# Altium schematic sheet Sheet_manual.SchDoc
size A3
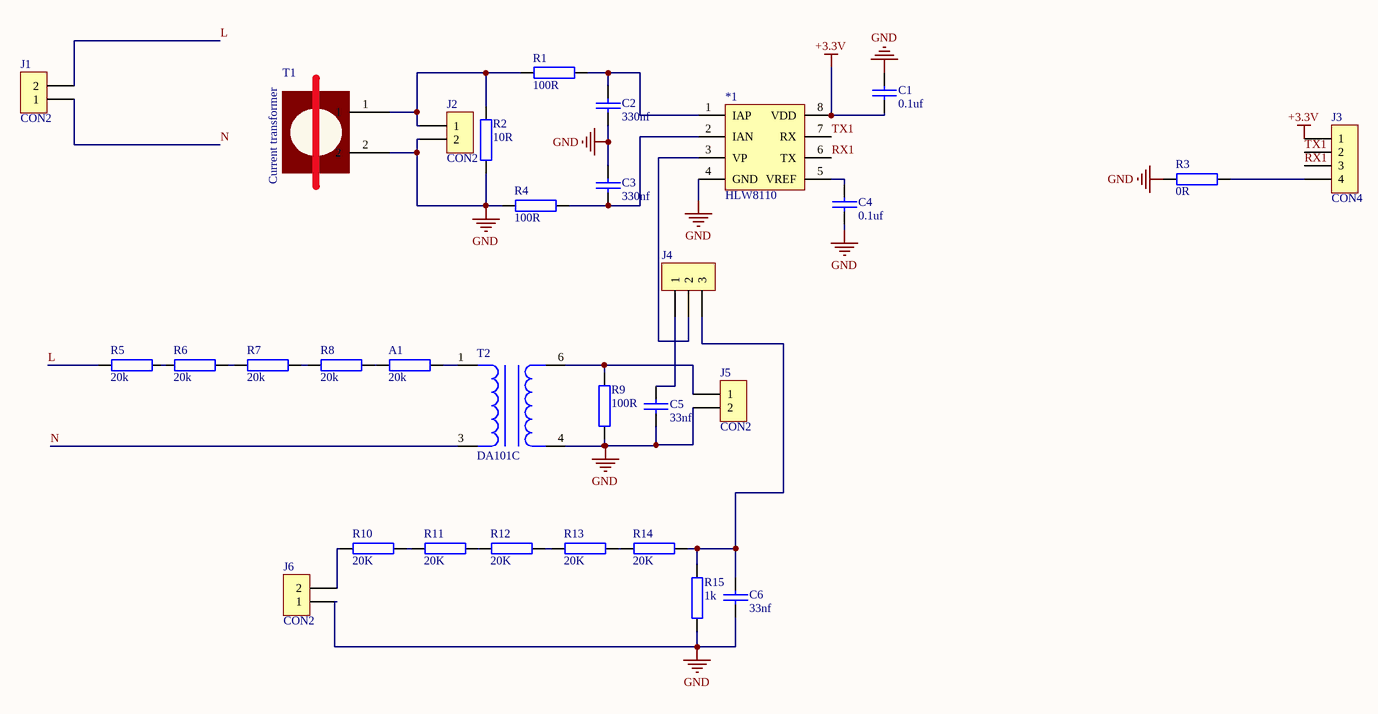
[diagram p0: Sheet_manual.SchDoc]

## Parts
*1  HLW8110  [SOP8W_M]
A1  20k  [AXIAL0.4]
C1  0.1uf  [CAP2]
C2  330nf  [CAP2]
C3  330nf  [CAP2]
C4  0.1uf  [CAP2]
C5  33nf  [CAP2]
C6  33nf  [CAP2]
J1  CON2  [KF128-3.81-2P]
J2  CON2  [sip-2]
J3  CON4  [sip-4]
J4  CON3  [sip-3]  (value not drawn)
J5  CON2  [sip-2]
J6  CON2  [sip-2]
R1  100R  [AXIAL0.4]
R2  10R  [AXIAL0.4]
R3  0R  [AXIAL0.4]
R4  100R  [AXIAL0.4]
R5  20k  [AXIAL0.4]
R6  20k  [AXIAL0.4]
R7  20k  [AXIAL0.4]
R8  20k  [AXIAL0.4]
R9  100R  [AXIAL0.4]
R10  20K  [AXIAL0.4]
R11  20K  [AXIAL0.4]
R12  20K  [AXIAL0.4]
R13  20K  [AXIAL0.4]
R14  20K  [AXIAL0.4]
R15  1k  [AXIAL0.4]
T1  Current transformer  [ZMCT103C]
T2  DA101C  [ZMPT101B]

## Nets
+3.3V: *1.8(VDD) C1.2 J3.1
GND: *1.4(GND) C1.1 C2.2 C3.1 C4.2 C5.2 C6.2 J2.2 J5.2 J6.1 R2.1 R3.1 R4.1 R9.1 R15.1 T1.2 T2.4
L: J1.2 R5.1
N: J1.1 T2.3
RX1: *1.6(TX) J3.3
TX1: *1.7(RX) J3.2
Net*1_1: *1.1(IAP) C2.1 R1.2
Net*1_2: *1.2(IAN) C3.2 R4.2
Net*1_3: *1.3(VP) J4.2
Net*1_5: *1.5(VREF) C4.1
NetA1_1: A1.1 R8.2
NetA1_2: A1.2 T2.1
NetC5_1: C5.1 J4.1
NetC6_1: C6.1 J4.3 R14.2 R15.2
NetJ2_1: J2.1 R1.1 R2.2 T1.1
NetJ3_4: J3.4 R3.2
NetJ5_1: J5.1 R9.2 T2.6
NetJ6_2: J6.2 R10.1
NetR5_2: R5.2 R6.1
NetR6_2: R6.2 R7.1
NetR7_2: R7.2 R8.1
NetR10_2: R10.2 R11.1
NetR11_2: R11.2 R12.1
NetR12_2: R12.2 R13.1
NetR13_2: R13.2 R14.1

## Library data of the parts
A1 R1-R15 = RES: 电阻
C1-C6 = CAP1
J1 J2 J5 J6 = CON2: Connector
J3 = CON4: Connector
J4 = CON3: Connector
T2 = DA10XC: 数字隔离变压器; pin to pad: 3>2 6>3; 版权归属: 源创客; ROM名称: 数字隔离变压器; 学习资源: www.ooocke.com